# Altium schematic sheet MB1189.SchDoc: MB1189
size A3; Date: 9/24/2014; Author: P.A.; CompanyName: STMicroelectronics; Organization: Microcontrollers Division; Address1: 12, Rue Jules HOROWITZ; Address2: 38019 Grenoble; Address3: FRANCE; DocumentNumber: MB1189; Revision: B-07; SheetNumber: 1; SheetTotal: 12; Project: STM32F469I-DISCO
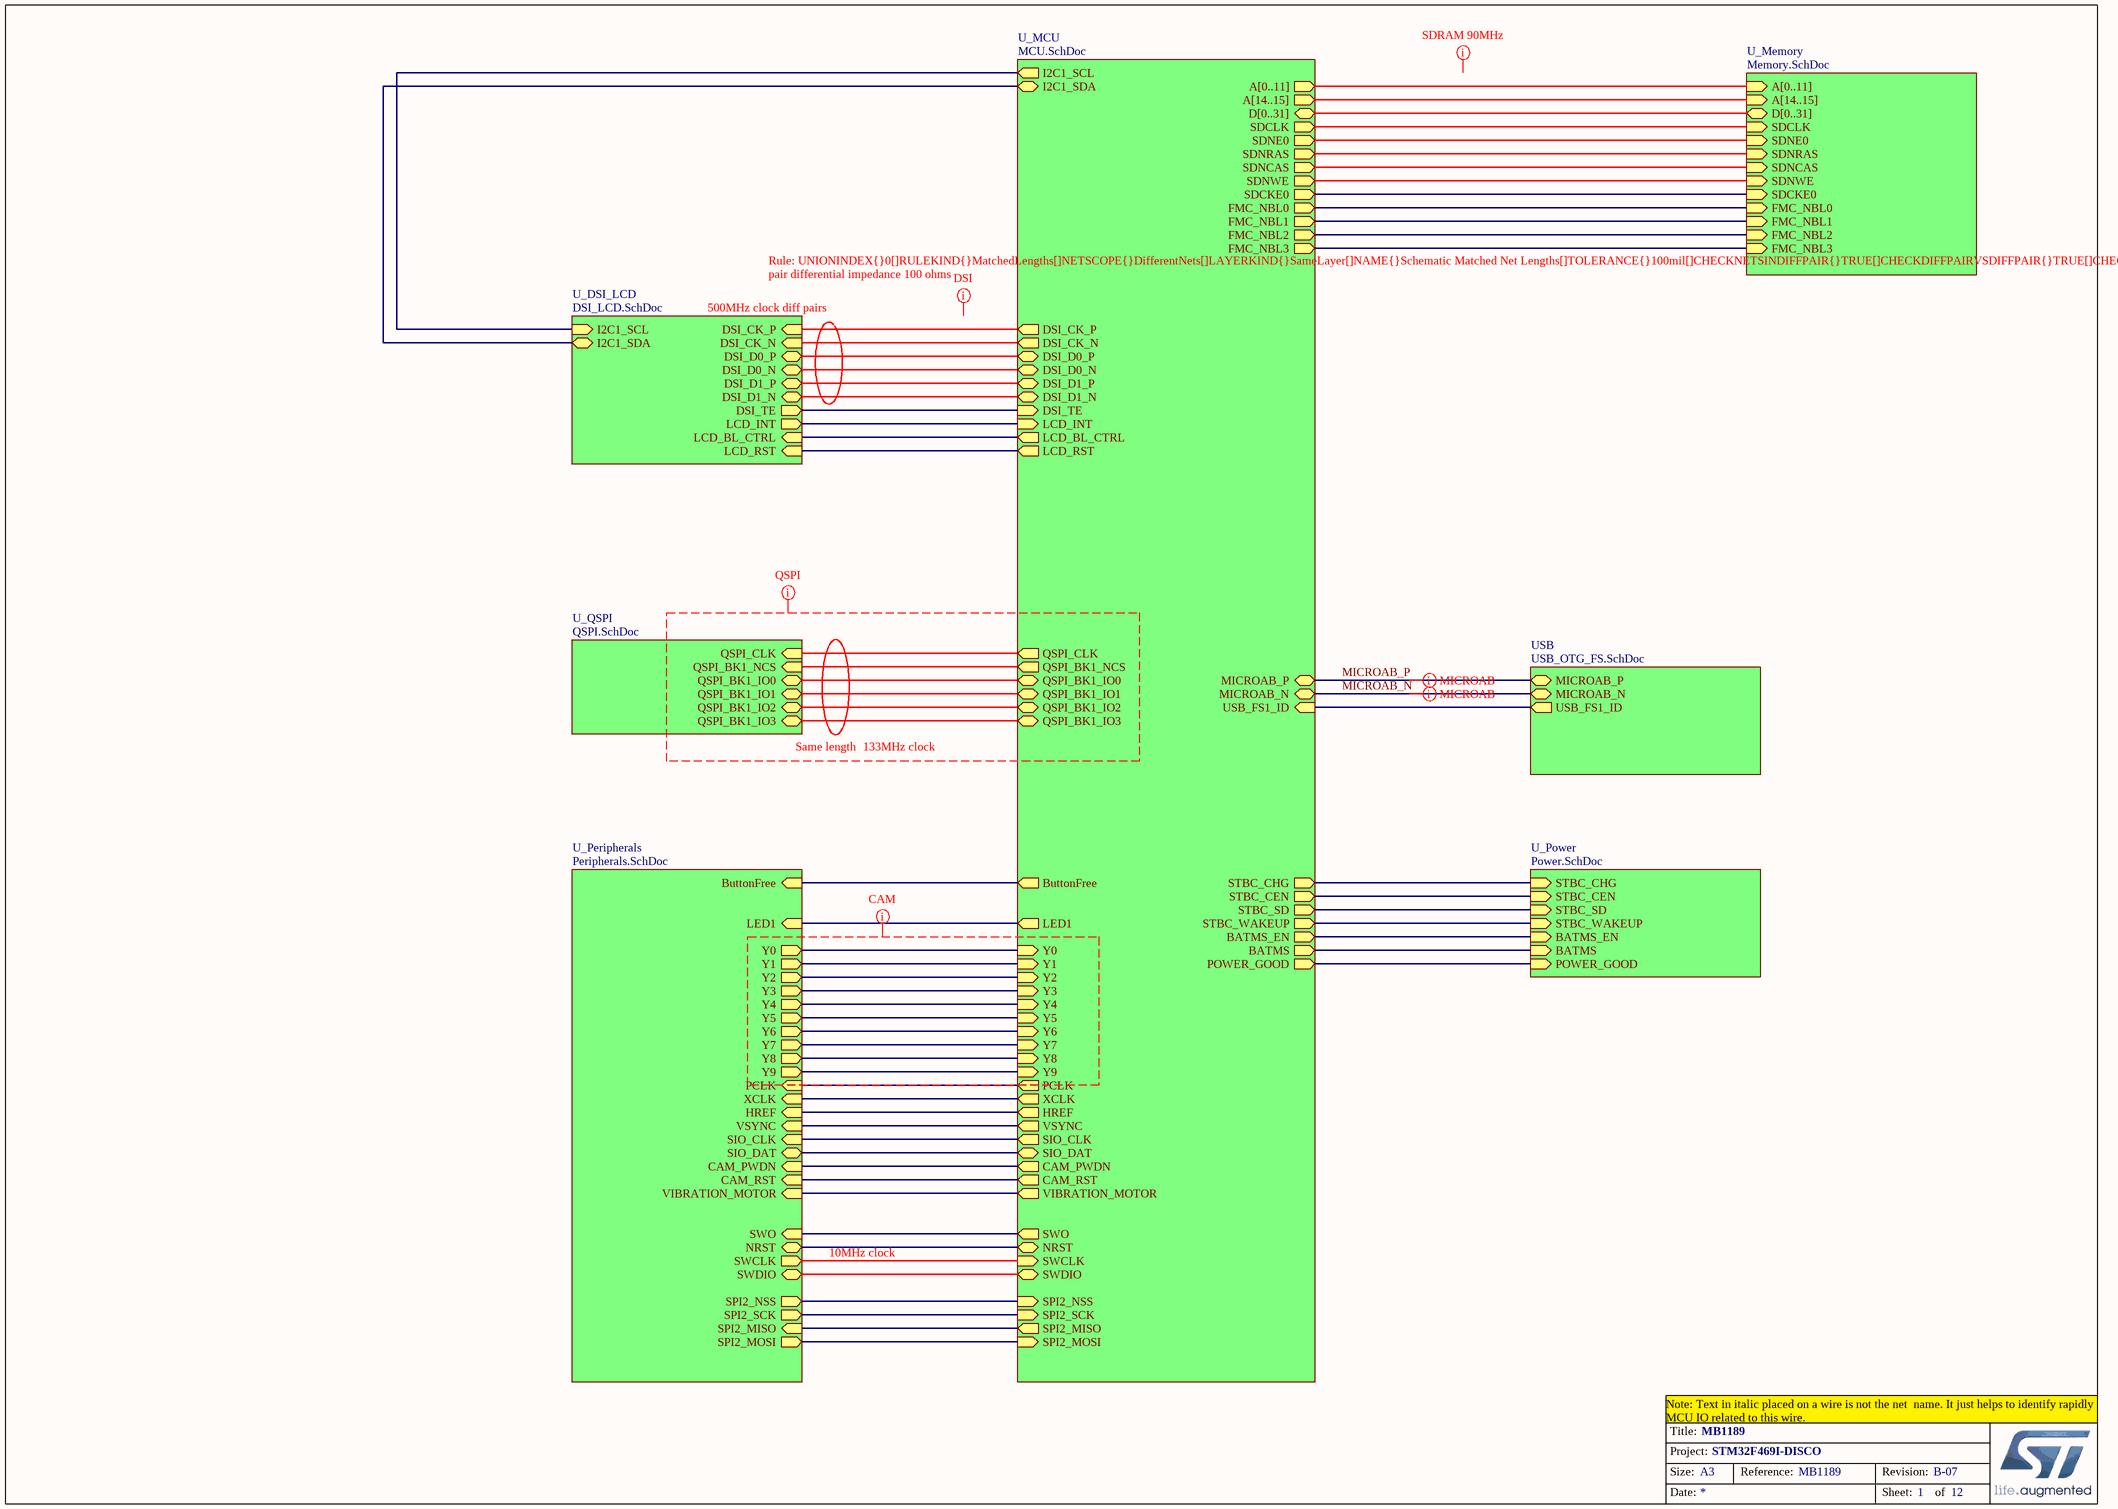
[diagram p0: MB1189.SchDoc]

## Sub-sheets
U_DSI_LCD = DSI_LCD.SchDoc: DSI_CK_P (in), DSI_CK_N (in), DSI_D0_P (bidir), DSI_D0_N (bidir), DSI_D1_P (bidir), DSI_D1_N (bidir), DSI_TE (out), I2C1_SDA (bidir), I2C1_SCL (in), LCD_BL_CTRL (in), LCD_INT (out), LCD_RST (in)
U_MCU = MCU.SchDoc: LCD_BL_CTRL (out), I2C1_SCL (out), I2C1_SDA (bidir), FMC_NBL3 (out), FMC_NBL2 (out), FMC_NBL0 (out), FMC_NBL1 (out), SDNRAS (out), SDCLK (out), SDNCAS (out), SDCKE0 (out), SDNE0 (out), SDNWE (out), D[0..31] (bidir), QSPI_CLK (out), QSPI_BK1_NCS (out), QSPI_BK1_IO3 (bidir), QSPI_BK1_IO2 (bidir), QSPI_BK1_IO1 (bidir), QSPI_BK1_IO0 (bidir), DSI_TE (in), DSI_CK_P (out), DSI_CK_N (out), DSI_D0_P (bidir), DSI_D0_N (bidir), DSI_D1_P (bidir), DSI_D1_N (bidir), NRST (bidir), LCD_INT (in), LED1 (out), SWCLK (in), SWDIO, A[0..11] (out), A[14..15] (out), LCD_RST (out), STBC_CHG (out), STBC_CEN (out), STBC_WAKEUP (out), STBC_SD (out), BATMS (out), BATMS_EN (out), POWER_GOOD (out), Y0 (in), Y1 (in), Y2 (in), Y3 (in), Y4 (in), Y5 (in), Y6 (in), Y7 (in), Y8 (in), PCLK (out), VSYNC (out), XCLK (out), HREF (out), SIO_CLK (out), CAM_PWDN (out), SIO_DAT (bidir), VIBRATION_MOTOR (out), CAM_RST (out), MICROAB_P (bidir), MICROAB_N (bidir), USB_FS1_ID (in), SWO (out), Y9 (in), ButtonFree (out), SPI2_NSS (in), SPI2_MISO (out), SPI2_SCK (in), SPI2_MOSI (in)
U_Memory = Memory.SchDoc: FMC_NBL0 (in), FMC_NBL1 (in), D[0..31] (bidir), SDNCAS (in), SDNWE (in), SDNRAS (in), SDNE0 (in), SDCKE0 (in), SDCLK (in), FMC_NBL3 (in), FMC_NBL2 (in), A[0..11] (in), A[14..15] (in)
U_Peripherals = Peripherals.SchDoc: LED1 (in), Y0 (out), Y1 (out), Y2 (out), Y3 (out), Y4 (out), Y5 (out), Y6 (out), Y7 (out), Y8 (out), PCLK (in), VSYNC (in), XCLK (in), HREF (in), SIO_CLK (in), CAM_PWDN (in), SIO_DAT (bidir), VIBRATION_MOTOR (in), CAM_RST (in), SWDIO, SWCLK (out), NRST (bidir), SWO (in), Y9 (out), ButtonFree (in), SPI2_NSS (out), SPI2_MISO (in), SPI2_SCK (out), SPI2_MOSI (out)
U_Power = Power.SchDoc: STBC_CHG (in), STBC_CEN (in), STBC_WAKEUP (in), STBC_SD (in), BATMS (in), BATMS_EN (in), POWER_GOOD (in)
U_QSPI = QSPI.SchDoc: QSPI_BK1_IO0 (bidir), QSPI_BK1_IO2 (bidir), QSPI_BK1_IO1 (bidir), QSPI_CLK (in), QSPI_BK1_NCS (in), QSPI_BK1_IO3 (bidir)
USB = USB_OTG_FS.SchDoc: MICROAB_P (bidir), MICROAB_N (bidir), USB_FS1_ID (out)

## Nets
MICROAB_N: sheet U_MCU/MICROAB_N, sheet USB/MICROAB_N
MICROAB_P: sheet U_MCU/MICROAB_P, sheet USB/MICROAB_P
(unnamed): sheet U_Memory/FMC_NBL0, sheet U_MCU/FMC_NBL0
(unnamed): sheet U_Memory/FMC_NBL1, sheet U_MCU/FMC_NBL1
(unnamed): sheet U_Memory/SDNCAS, sheet U_MCU/SDNCAS
(unnamed): sheet U_Memory/SDNWE, sheet U_MCU/SDNWE
(unnamed): sheet U_Memory/SDNRAS, sheet U_MCU/SDNRAS
(unnamed): sheet U_Memory/SDNE0, sheet U_MCU/SDNE0
(unnamed): sheet U_Memory/SDCKE0, sheet U_MCU/SDCKE0
(unnamed): sheet U_Memory/SDCLK, sheet U_MCU/SDCLK
(unnamed): sheet U_Memory/FMC_NBL3, sheet U_MCU/FMC_NBL3
(unnamed): sheet U_Memory/FMC_NBL2, sheet U_MCU/FMC_NBL2
(unnamed): sheet U_Peripherals/LED1, sheet U_MCU/LED1
(unnamed): sheet U_Peripherals/Y0, sheet U_MCU/Y0
(unnamed): sheet U_Peripherals/Y1, sheet U_MCU/Y1
(unnamed): sheet U_Peripherals/Y2, sheet U_MCU/Y2
(unnamed): sheet U_Peripherals/Y3, sheet U_MCU/Y3
(unnamed): sheet U_Peripherals/Y4, sheet U_MCU/Y4
(unnamed): sheet U_Peripherals/Y5, sheet U_MCU/Y5
(unnamed): sheet U_Peripherals/Y6, sheet U_MCU/Y6
(unnamed): sheet U_Peripherals/Y7, sheet U_MCU/Y7
(unnamed): sheet U_Peripherals/Y8, sheet U_MCU/Y8
(unnamed): sheet U_Peripherals/PCLK, sheet U_MCU/PCLK
(unnamed): sheet U_Peripherals/VSYNC, sheet U_MCU/VSYNC
(unnamed): sheet U_Peripherals/XCLK, sheet U_MCU/XCLK
(unnamed): sheet U_Peripherals/HREF, sheet U_MCU/HREF
(unnamed): sheet U_Peripherals/SIO_CLK, sheet U_MCU/SIO_CLK
(unnamed): sheet U_Peripherals/CAM_PWDN, sheet U_MCU/CAM_PWDN
(unnamed): sheet U_Peripherals/SIO_DAT, sheet U_MCU/SIO_DAT
(unnamed): sheet U_Peripherals/VIBRATION_MOTOR, sheet U_MCU/VIBRATION_MOTOR
(unnamed): sheet U_Peripherals/CAM_RST, sheet U_MCU/CAM_RST
(unnamed): sheet U_Peripherals/SWDIO, sheet U_MCU/SWDIO
(unnamed): sheet U_Peripherals/SWCLK, sheet U_MCU/SWCLK
(unnamed): sheet U_Peripherals/NRST, sheet U_MCU/NRST
(unnamed): sheet U_Peripherals/SWO, sheet U_MCU/SWO
(unnamed): sheet U_Peripherals/Y9, sheet U_MCU/Y9
(unnamed): sheet U_Peripherals/ButtonFree, sheet U_MCU/ButtonFree
(unnamed): sheet U_Peripherals/SPI2_NSS, sheet U_MCU/SPI2_NSS
(unnamed): sheet U_Peripherals/SPI2_MISO, sheet U_MCU/SPI2_MISO
(unnamed): sheet U_Peripherals/SPI2_SCK, sheet U_MCU/SPI2_SCK
(unnamed): sheet U_Peripherals/SPI2_MOSI, sheet U_MCU/SPI2_MOSI
(unnamed): sheet U_Power/STBC_CHG, sheet U_MCU/STBC_CHG
(unnamed): sheet U_Power/STBC_CEN, sheet U_MCU/STBC_CEN
(unnamed): sheet U_Power/STBC_WAKEUP, sheet U_MCU/STBC_WAKEUP
(unnamed): sheet U_Power/STBC_SD, sheet U_MCU/STBC_SD
(unnamed): sheet U_Power/BATMS, sheet U_MCU/BATMS
(unnamed): sheet U_Power/BATMS_EN, sheet U_MCU/BATMS_EN
(unnamed): sheet U_Power/POWER_GOOD, sheet U_MCU/POWER_GOOD
(unnamed): sheet U_MCU/LCD_BL_CTRL, sheet U_DSI_LCD/LCD_BL_CTRL
(unnamed): sheet U_MCU/I2C1_SCL, sheet U_DSI_LCD/I2C1_SCL
(unnamed): sheet U_MCU/I2C1_SDA, sheet U_DSI_LCD/I2C1_SDA
(unnamed): sheet U_MCU/QSPI_CLK, sheet U_QSPI/QSPI_CLK
(unnamed): sheet U_MCU/QSPI_BK1_NCS, sheet U_QSPI/QSPI_BK1_NCS
(unnamed): sheet U_MCU/QSPI_BK1_IO3, sheet U_QSPI/QSPI_BK1_IO3
(unnamed): sheet U_MCU/QSPI_BK1_IO2, sheet U_QSPI/QSPI_BK1_IO2
(unnamed): sheet U_MCU/QSPI_BK1_IO1, sheet U_QSPI/QSPI_BK1_IO1
(unnamed): sheet U_MCU/QSPI_BK1_IO0, sheet U_QSPI/QSPI_BK1_IO0
(unnamed): sheet U_MCU/DSI_TE, sheet U_DSI_LCD/DSI_TE
(unnamed): sheet U_MCU/DSI_CK_P, sheet U_DSI_LCD/DSI_CK_P
(unnamed): sheet U_MCU/DSI_CK_N, sheet U_DSI_LCD/DSI_CK_N
(unnamed): sheet U_MCU/DSI_D0_P, sheet U_DSI_LCD/DSI_D0_P
(unnamed): sheet U_MCU/DSI_D0_N, sheet U_DSI_LCD/DSI_D0_N
(unnamed): sheet U_MCU/DSI_D1_P, sheet U_DSI_LCD/DSI_D1_P
(unnamed): sheet U_MCU/DSI_D1_N, sheet U_DSI_LCD/DSI_D1_N
(unnamed): sheet U_MCU/LCD_INT, sheet U_DSI_LCD/LCD_INT
(unnamed): sheet U_MCU/LCD_RST, sheet U_DSI_LCD/LCD_RST
(unnamed): sheet U_MCU/USB_FS1_ID, sheet USB/USB_FS1_ID

## Buses and harness runs
bus sheet U_MCU/A[0..11] = sheet U_Memory/A[0..11]
bus sheet U_MCU/A[14..15] = sheet U_Memory/A[14..15]
bus sheet U_MCU/D[0..31] = sheet U_Memory/D[0..31]

## Layout directives
mark named SDRAM 90MHz: (no net found under the mark)
rule Matched Net Lengths [Tolerance = 100mil]; rule ? : (no net found under the mark)
differential pair: MICROAB_N, MICROAB_P
net class Cam: (no net found under the mark)
net class QSPI: (no net found under the mark)

## Notes on the sheet
- 500MHz clock diff pairs
- Same length
- 133MHz clock
- 10MHz clock
- Note: Text in italic placed on a wire is not the net  name. It just helps to identify rapidly MCU IO related to this wire.
- Title:
- Project:
- Size:
- Date:
- A3
- Reference:
- Sheet:
- Revision:
- of